# Altium schematic sheet 3_单片机最小系统.schdoc.schdoc
size 431 x 309 mm; Symbol: Sheet-Symbol_A3; Device: Sheet-Symbol_A3; Company: 深圳嘉立创科技发展有限公司; Drawed: 嘉立创EDA; Reviewed: 嘉立创EDA; Version: V0.1; Page Size: A2; @Project Name: 毕业设计板子1; @Page Count: 3; @Update Date: 2024-03-01; @Create Date: 2024-02-22; @Schematic Name: Schematic1; Part Number: JLCPCB-001; @Page No: 2; @Page Name: 单片机最小系统
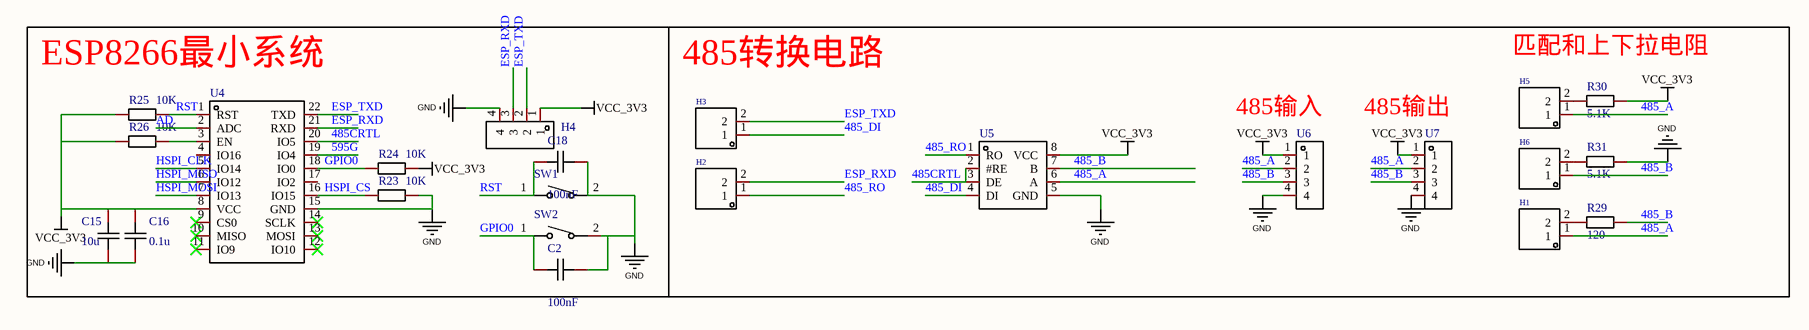
[diagram p0: 3_单片机最小系统.schdoc.schdoc]

## Parts
C2  value 100nF  [C0402]  (hidden comment: CAP_0402)
C15  value 10u  [C0402]  (hidden comment: CAP_0402)
C16  value 0.1u  [C0402]  (hidden comment: CAP_0402)
C18  value 100nF  [C0402]  (hidden comment: CAP_0402)
H1  HDR-M_2.54_1x2P  [HDR-TH_2P-P2.54-V-M-1]  (value not drawn)
H2  HDR-M_2.54_1x2P  [HDR-TH_2P-P2.54-V-M-1]  (value not drawn)
H3  HDR-M_2.54_1x2P  [HDR-TH_2P-P2.54-V-M-1]  (value not drawn)
H4  HDR-M_2.54_1x4P  [HDR-TH_4P-P2.54-V-M]  (value not drawn)
H5  HDR-M_2.54_1x2P  [HDR-TH_2P-P2.54-V-M-1]  (value not drawn)
H6  HDR-M_2.54_1x2P  [HDR-TH_2P-P2.54-V-M-1]  (value not drawn)
R23  value 10K  [R0402]  (hidden comment: Res_0402)
R24  value 10K  [R0402]  (hidden comment: Res_0402)
R25  value 10K  [R0402]  (hidden comment: Res_0402)
R26  value 10K  [R0402]  (hidden comment: Res_0402)
R29  value 120  [R0402]  (hidden comment: Res_0402)
R30  value 5.1K  [R0402]  (hidden comment: Res_0402)
R31  value 5.1K  [R0402]  (hidden comment: Res_0402)
SW1  TS-KG88C-ACT25F  [KEY-SMD_L4.0-W2.9-LS4.8]  (value not drawn)
SW2  TS-KG88C-ACT25F  [KEY-SMD_L4.0-W2.9-LS4.8]  (value not drawn)
U4  SMDESP8266-12F  [WIFIM-SMD_22P-L24.0-W16.0-P2.00-SMDESP8266-12F]  (value not drawn)
U5  MAX3485ESA  [SOP-8_L5.0-W4.0-P1.27-LS6.0-BL]  (value not drawn)
U6  DB125-2.54-4P-GN-S  [CONN-TH_DB125-2.54-4P-GN]  (value not drawn)
U7  DB125-2.54-4P-GN-S  [CONN-TH_DB125-2.54-4P-GN]  (value not drawn)

## Blocks framed on the sheet
ESP8266最小系统: C2 C15 C16 C18 H4 R23-R26 SW1 SW2 U4
485转换电路: H1-H3 H5 H6 R29-R31 U5-U7

## Nets
GND: C2.2 C15.1 C16.1 C18.2 H4.4 R23.2 R31.2 SW1.2 SW2.2 U4.15(GND) U5.5(GND) U6.4 U7.4
VCC_3V3: C15.2 C16.2 H4.1 R24.2 R25.1 R26.1 R30.2 U4.8(VCC) U5.8(VCC) U6.1 U7.1
485_A: H1.1 H5.1 U5.6(A) U6.2 U7.2
485_B: H6.1 R29.2 U5.7(B) U6.3 U7.3
485_DI: H3.1 U5.4(DI)
485_RO: H2.1 U5.1(RO)
485CRTL: U4.20(IO5) U5.2(#RE) U5.3(DE)
595G: U4.19(IO4)
AD: U4.2(ADC)
ESP_RXD: H2.2 H4.3 U4.21(RXD)
ESP_TXD: H3.2 H4.2 U4.22(TXD)
GPIO0: C2.1 R24.1 SW2.1 U4.18(IO0)
HSPI_CLK: U4.5(IO14)
HSPI_CS: R23.1 U4.16(IO15)
HSPI_MISO: U4.6(IO12)
HSPI_MOSI: U4.7(IO13)
RST: C18.1 R25.2 SW1.1 U4.1(RST)
NetH1_2: H1.2 R29.1
NetH5_2: H5.2 R30.1
NetH6_2: H6.2 R31.1
NetR26_2: R26.2 U4.3(EN)

Not connected (* = marked no-connect by the designer): U4 4(IO16) 9(CS0)* 10(MISO)* 11(IO9)* 12(IO10)* 13(MOSI)* 14(SCLK)* 17(IO2)

## Notes on the sheet
- 匹配和上下拉电阻
- (near U6) 485输入
- (near U7) 485输出
- 1
- 2
- 3
- 4
- 5
- 6
- A
- B
- C
- 原理图
- Schematic1
- 创建日期
- 更新日期
- 2024-03-01
- 2024-02-22
- D
- 审阅
- 绘制
- 图页
- 嘉立创EDA
- 单片机最小系统
- 物料编码
- 毕业设计板子1
- JLCPCB-001
- 版本
- 尺寸
- 页
- 共
- V0.1
- A2
- 深圳嘉立创科技发展有限公司

## Library data of the parts
C2 C15 C16 C18 = CAP_0402: Symbol: CapAcitance; Convert to PCB: yes; Device: CAP_0402; Add into BOM: yes; Supplier Footprint: 0402
H1-H3 H5 H6 = HDR-M_2.54_1x2P: Manufacturer: Ckmtw(灿科盟); Manufacturer Part: B-2100S02P-A110; Symbol: 210S-1*2P L=11.6MMGold-plated black; Convert to PCB: yes; Device: HDR-M_2.54_1x2P; Supplier: LCSC; Supplier Part: C124375; JLCPCB Part Class: Extended Part; Add into BOM: yes; Supplier Footprint: 插件
H4 = HDR-M_2.54_1x4P: Manufacturer: XFCN(兴飞); Symbol: PZ254V-11-04P; Convert to PCB: yes; Device: HDR-M_2.54_1x4P; Supplier: LCSC; Supplier Part: C492403; Manufacturer Part: PZ254V-11-04P; JLCPCB Part Class: Extended Part; Add into BOM: yes; Supplier Footprint: 插件
R23-R26 R29-R31 = Res_0402: Symbol: 电阻; Convert to PCB: yes; Device: Res_0402; Add into BOM: yes; Supplier Footprint: 0402
SW1 SW2 = TS-KG88C-ACT25F: Manufacturer: HANBO(汉博); Add into BOM: yes; Circuit: 单刀单掷; Actuator Style: 圆形按钮; Operating Force: 250gf; Switch Length: 4mm; Switch Width: 2.9mm; Switch Height: 2.5mm; Strike Gundam: 不带; Contact Current: 50mA; Voltage Rating (DC): 12V; Insulation Resistance: 100MΩ; Actuator/Cap Color: 黑色; Pin Style: SMD接片; Description: 电路结构:单刀单掷;按钮形状:圆形按钮;作用力:250gf;安装方式:立贴;开关长度:4mm;开关宽度:2.9mm;开关高度:2.5mm;带支架:不带;触点电流:50mA;额定电压(DC):12V;绝缘电阻:100MΩ;机械寿命:-;; Symbol: TS-KG88C-ACT25F; Device: TS-KG88C-ACT25F; Supplier: LCSC; Supplier Part: C2874431; Manufacturer Part: TS-KG88C-ACT25F; JLCPCB Part Class: 扩展库; LCSC Part Name: 4*2.9*2.5mm 立贴 轻触开关; Supplier Footprint: SMD; Datasheet: https://atta.szlcsc.com/upload/public/pdf/source/20221110/31A67B2BF627E0CABA86909E5DE0C9EA.pdf; Convert to PCB: yes; Mounting Style: 立贴; Mechanical Life: -
U4 = SMDESP8266-12F: Add into BOM: yes; Symbol: SMDESP8266-12F; Device: SMDESP8266-12F; LCSC Part Name: SMDESP8266-12F; Supplier Part: C9900003458; Manufacturer Part: SMDESP8266-12F; Supplier Footprint: SMD; JLCPCB Part Class: 扩展库; Supplier: LCSC; Convert to PCB: yes
U5 = MAX3485ESA: Manufacturer: UMW(友台半导体); Add into BOM: yes; Types: 收发器; Supply Voltage: 2.97V~3.63V; Data Rate: 12Mbps; Driver/receiver: 1/1; Description: 类型:收发器;数据速率:12Mbps;驱动器/接收器:1/1;; Symbol: MAX3485ESA; Device: MAX3485ESA; LCSC Part Name: MAX3485ESA; Supplier Part: C668204; Manufacturer Part: MAX3485ESA; Supplier Footprint: SOP-8; JLCPCB Part Class: 扩展库; Datasheet: https://atta.szlcsc.com/upload/public/pdf/source/20231109/DDD7CD3D891754087D6BC3897133907F.pdf; Supplier: LCSC; Convert to PCB: yes; Operating Temperature: -40℃~+85℃
U6 U7 = DB125-2.54-4P-GN-S: Manufacturer: DORABO(地博电气); Add into BOM: yes; Structure: 1x4P; Pitch: 2.54mm; Current Rating (Max): 8A; Voltage Rating (Max): 130V; Wire Gauge - AWG: 18~26; Wire Gauge - mm2: 0.5~1; Number of PINs Per Row: 4; Description: 结构:1x4P;间距:2.54mm;颜色:绿色;安装方式:直插;额定电流:8A;额定电压:130V;排数:1;线规 - AWG:18~26;线规 - 平方毫米:0.5~1;每排PIN数:4;工作温度范围:-40℃~+105℃;; Symbol: DB125-2.54-4P-GN; Device: DB125-2.54-4P-GN-S; LCSC Part Name: 2.54mm 1x4P 排数:1 每排P数:4 直插; Supplier Part: C918122; Manufacturer Part: DB125-2.54-4P-GN-S; Supplier Footprint: 插件,P=2.54mm; JLCPCB Part Class: 扩展库; Datasheet: https://atta.szlcsc.com/upload/public/pdf/source/20230106/BCD3A0BE1EB95DC3E813F1745F022035.pdf; Supplier: LCSC; Convert to PCB: yes; Color: 绿色; Mounting Style: 直插; Number of Pins: 4P; Number of Rows: 1; Operating Temperature Range: -40℃~+105℃